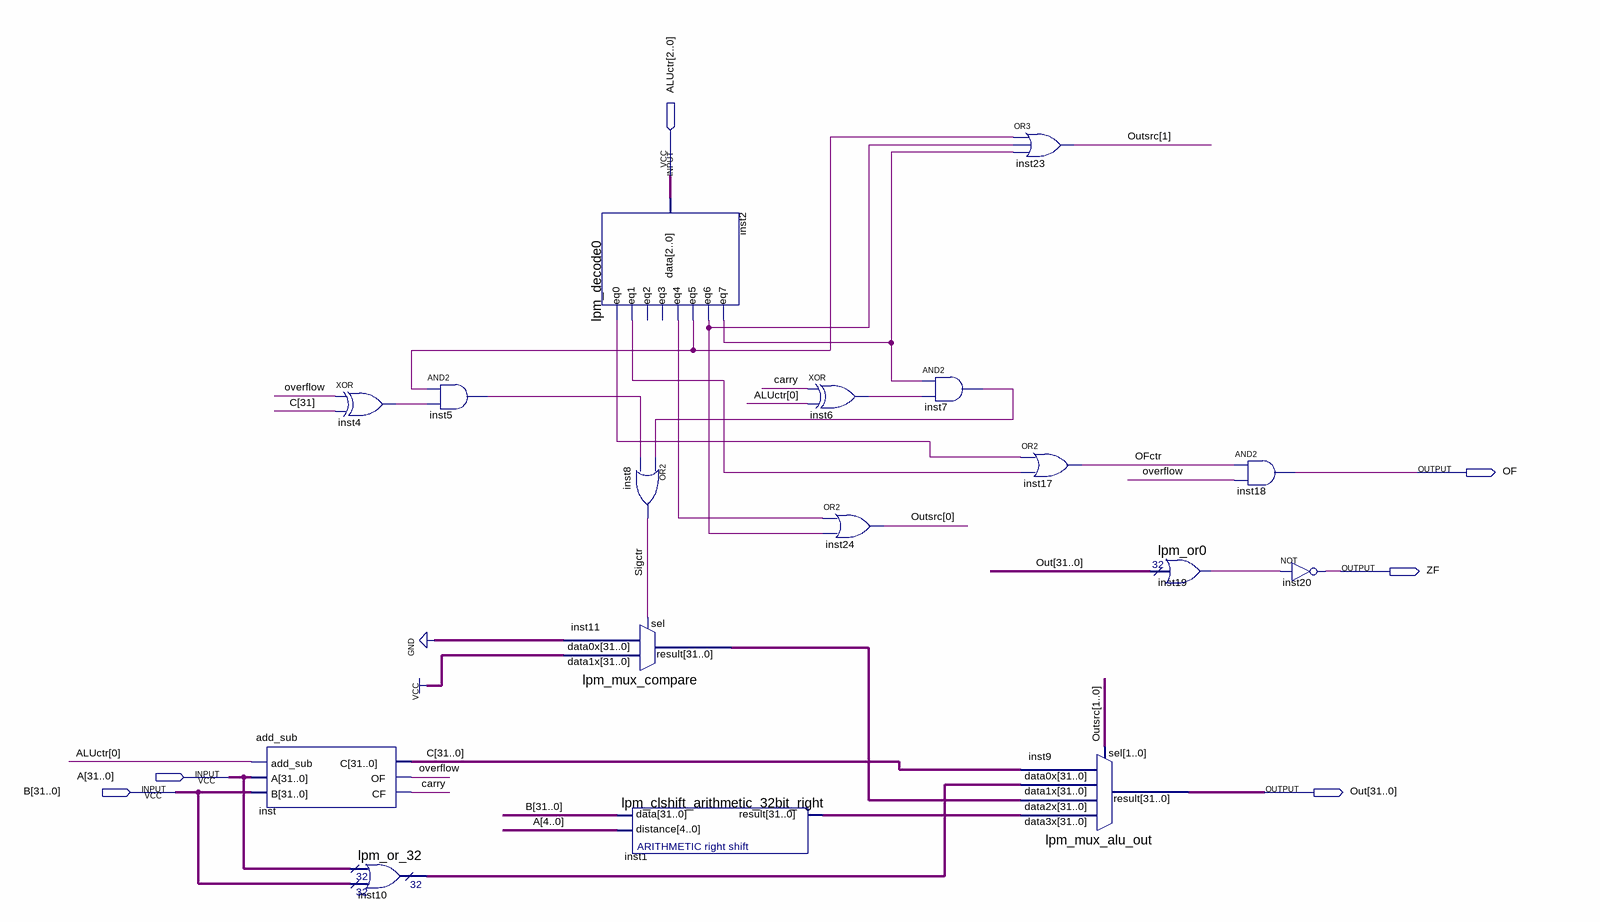
[diagram p0: schematic sheet]
// Quartus schematic ALU.bdf as structural Verilog: 17 symbols, 6 pins
module ALU (
  input  [2:0] ALUctr,
  input  [31:0] A,
  input  [31:0] B,
  output OF,
  output ZF,
  output [31:0] Out
);

  wire carry, inst2_eq0, inst2_eq1, inst2_eq4, inst2_eq5, inst2_eq6, inst2_eq7, inst4_out, inst5_out,
       inst6_out, inst7_out, inst19_result, OFctr, overflow, Sigctr;
  wire [1:0] Outsrc;
  wire [31:0] C, inst1_result, inst10_result, inst11_result;

  add_sub inst (.add_sub(ALUctr[0]), .A(A), .B(B), .C(C), .OF(overflow), .CF(carry));
  xor inst4 (inst4_out, overflow, C[31]);
  lpm_or_32 inst10 (.data0x(A), .data1x(B), .result(inst10_result));
  and inst5 (inst5_out, inst2_eq5, inst4_out);
  lpm_mux_compare inst11 (.data1x({32{1'b1}}), .data0x({32{1'b0}}), .sel(Sigctr), .result(inst11_result));
  lpm_decode0 inst2 (
    .data(ALUctr), .eq0(inst2_eq0), .eq1(inst2_eq1), .eq4(inst2_eq4), .eq5(inst2_eq5), .eq6(inst2_eq6),
    .eq7(inst2_eq7));  // open: eq2, eq3
  or inst8 (Sigctr, inst7_out, inst5_out);
  lpm_clshift_arithmetic_32bit_right inst1 (.data(B), .distance(A[4:0]), .result(inst1_result));
  xor inst6 (inst6_out, carry, ALUctr[0]);
  or inst24 (Outsrc[0], inst2_eq4, inst2_eq6);
  and inst7 (inst7_out, inst2_eq7, inst6_out);
  or inst23 (Outsrc[1], inst2_eq5, inst2_eq6, inst2_eq7);
  or inst17 (OFctr, inst2_eq0, inst2_eq1);
  lpm_mux_alu_out inst9 (
    .data3x(inst1_result), .data2x(inst11_result), .data1x(inst10_result), .data0x(C), .sel(Outsrc),
    .result(Out));
  lpm_or0 inst19 (.data(Out), .result(inst19_result));
  and inst18 (OF, OFctr, overflow);
  not inst20 (ZF, inst19_result);
endmodule
